# EAGLE board synth_revD (EAGLE 6.6.0), part 1 of 2
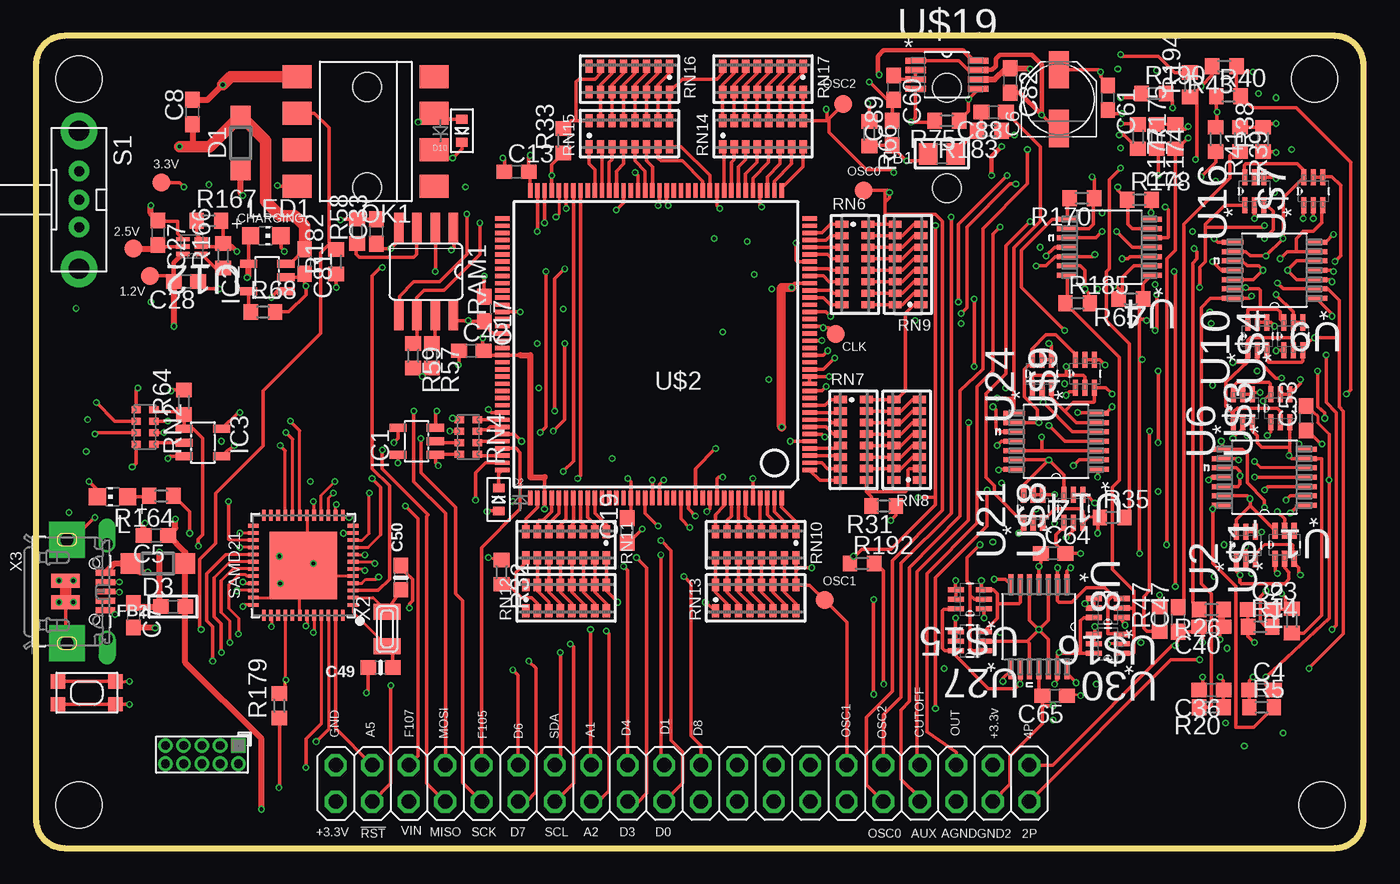
[diagram p6: board, top side]
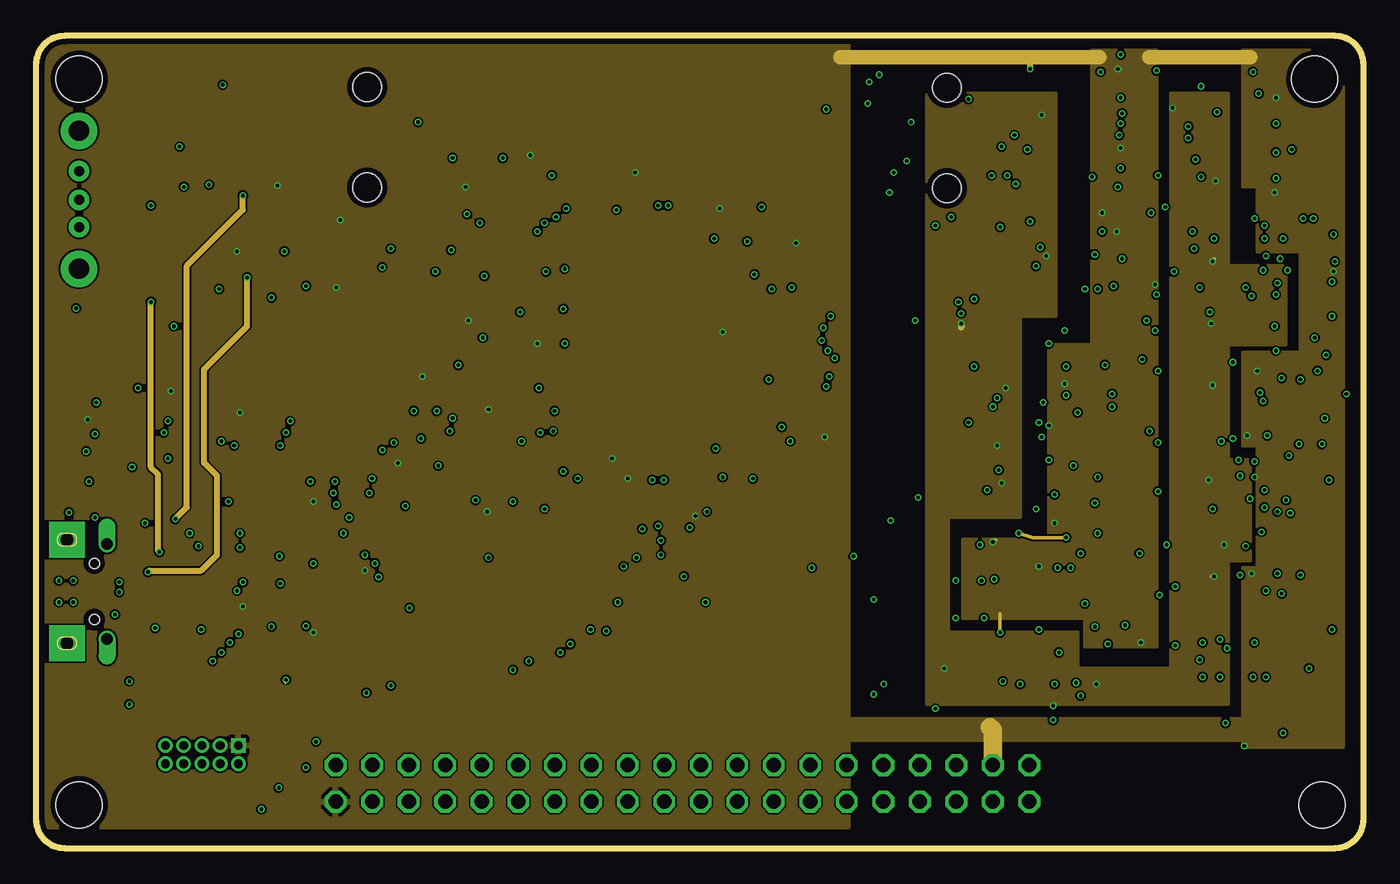
[diagram p7: board, inner layer Route2]
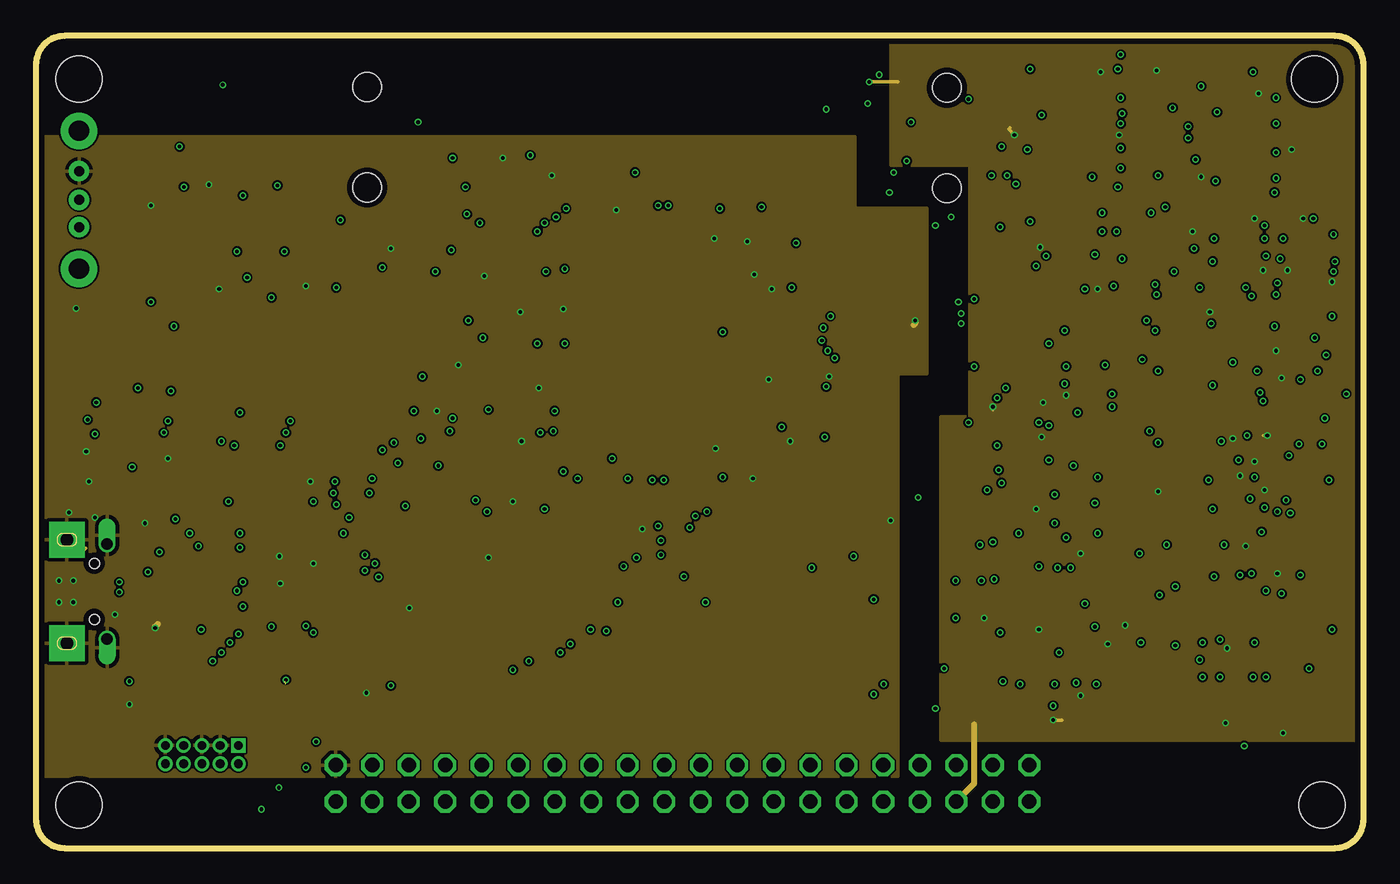
[diagram p8: board, inner layer Route15]
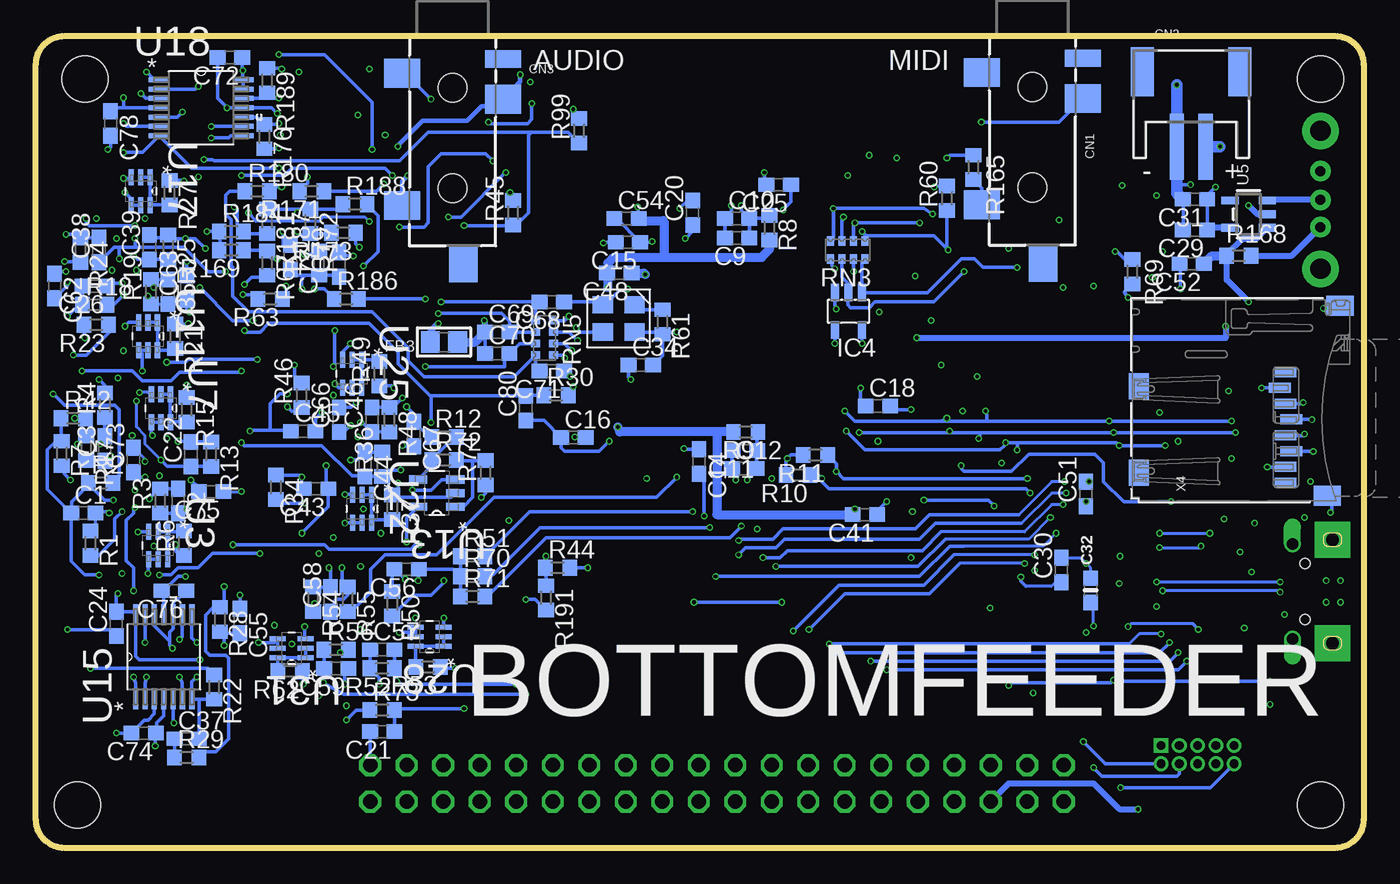
[diagram p9: board, bottom side, seen from below]

Size 92.4 x 56.5 mm. Coordinates in mm from the lower left corner, seen from the top.
Outline: 2,0 90.4,0 arc90 92.4,2 92.4,54.5 arc90 90.4,56.5 2,56.5 arc90 0,54.5 0,2 arc90 2,0
Copper layers (1*2*15*16): Top 0.035559375mm / dielectric 0.17018125mm / Route2 0.01778125mm / dielectric 47mil / Route15 0.01778125mm / dielectric 0.17018125mm / Bottom 0.035559375mm
Design rules "OSHPark-4layer *": minimum track width 5mil, minimum drill 10mil, track to track 5mil, track to pad 5mil, pad to pad 5mil, via to via 5mil, smd to smd 0mil, copper to edge 15mil, drill to drill 6mil, minimum pad ring 4mil, minimum via ring 4mil, stop-mask expansion 0mil, vias tented up to drill 0mil, thermal gap 10mil
Net classes: 3 usbvcc: width 0.102 mm, drill 0.1 mm, clearance 0.15 mm
Holes 3.2 mm at 89,53.5 3,53.5 89.5,3 3,3

## Footprints (pad centres in the part's own frame; a part is rotated, then mirrored left to right if it is on the bottom)
B1,27 = smd 1.27 x 1.27: TP 0,0
C0603 = smd 1.1 x 1: 1 -0.85,0; 2 0.85,0
PANASONIC_C = smd 2.6 x 1.4: + 2.05,0; - -2.05,0
0603-NO = smd 1.075 x 1: 1 -0.85,0; 2 0.85,0
4UCONN_19269 = smd 2 x 2.5: 1 2.5,-3.5; 2 11.7,-3.5; 3 4.3,3.5 | smd 2.5 x 2: 4 15.8,0.75 | smd 1.2 x 2.5: 5 1.5,3.5 | hole 2: 3.5,0; 10.5,0
JST-PH-2-SMT-RA = smd 1 x 4.6: 1 1,-3.7; 2 -1,-3.7 | smd 1.6 x 3.4: NC1 -3.4,1.5; NC2 3.4,1.5
SOD123 = smd 1.4 x 1.4: A 1.9,0; C -1.9,0
SOD-523 = smd 0.8 x 0.6: A 0,-0.8; K 0,0.8
0805 = smd 1.3 x 1.5: 1 -0.95,0; 2 0.95,0
0603 = smd 1.1 x 1: 1 -0.85,0; 2 0.85,0
SOT23-5L = smd 0.55 x 1.2: 1 -0.95,-1.3; 2 0,-1.3; 3 0.95,-1.3; 4 0.95,1.3; 5 -0.95,1.3
PINHEAD_2X05_127 = drill 0.6 pad 1.016 square: 1 -0.635,2.54 | drill 0.6 pad 1.016: 2 0.635,2.54; 3 -0.635,1.27; 4 0.635,1.27; 5 -0.635,0; 6 0.635,0; 7 -0.635,-1.27; 8 0.635,-1.27; 9 -0.635,-2.54; 10 0.635,-2.54
2X20 = drill 1.016 octagon: 1 -24.13,-1.27; 2 -24.13,1.27; 3 -21.59,-1.27; 4 -21.59,1.27; 5 -19.05,-1.27; 6 -19.05,1.27; 7 -16.51,-1.27; 8 -16.51,1.27; 9 -13.97,-1.27; 10 -13.97,1.27; 11 -11.43,-1.27; 12 -11.43,1.27; 13 -8.89,-1.27; 14 -8.89,1.27; 15 -6.35,-1.27; 16 -6.35,1.27; 17 -3.81,-1.27; 18 -3.81,1.27; 19 -1.27,-1.27; 20 -1.27,1.27; 21 1.27,-1.27; 22 1.27,1.27; 23 3.81,-1.27; 24 3.81,1.27; 25 6.35,-1.27; 26 6.35,1.27; 27 8.89,-1.27; 28 8.89,1.27; 29 11.43,-1.27; 30 11.43,1.27; 31 13.97,-1.27; 32 13.97,1.27; 33 16.51,-1.27; 34 16.51,1.27; 35 19.05,-1.27; 36 19.05,1.27; 37 21.59,-1.27; 38 21.59,1.27; 39 24.13,-1.27; 40 24.13,1.27
CHIP-LED0805 = smd 1.2 x 1.2: A 0,-1.05; C 0,1.05
DIL8-SMD = smd 1.6 x 2: 1 -3.81,-4.77; 2 -1.27,-4.77; 3 1.27,-4.77; 4 3.81,-4.77; 5 3.81,4.77; 6 1.27,4.77; 7 -1.27,4.77; 8 -3.81,4.77
R0603 = smd 1 x 1.1: 1 -0.85,0; 2 0.85,0
SO08 = smd 0.66 x 2.032: 1 -1.905,-3.073; 2 -0.635,-3.073; 3 0.635,-3.073; 4 1.905,-3.073; 5 1.905,3.073; 6 0.635,3.073; 7 -0.635,3.073; 8 -1.905,3.073
0603-ARC = smd 0.5 x 0.65: 1 -1.2,-0.625; 2 -0.4,-0.625; 3 0.4,-0.625; 4 1.2,-0.625; 5 1.2,0.625; 6 0.4,0.625; 7 -0.4,0.625; 8 -1.2,0.625
742-16 = smd 0.5 x 0.9: 1 -2.8,-0.9; 2 -2,-0.9; 3 -1.2,-0.9; 4 -0.4,-0.9; 5 0.4,-0.9; 6 1.2,-0.9; 7 2,-0.9; 8 2.8,-0.9; 9 2.8,0.9; 10 2,0.9; 11 1.2,0.9; 12 0.4,0.9; 13 -0.4,0.9; 14 -1.2,0.9; 15 -2,0.9; 16 -2.8,0.9
EG1213 = drill 0.7 pad 1.422: 1 -2,0; 2 0,0; 3 1.9,0 | drill 1.4 pad 2.54: MT1 -4.8,0; MT2 4.8,0
TQFN48_7MM = smd 0.25 x 0.75: 1 -2.75,-3.475; 2 -2.25,-3.475; 3 -1.75,-3.475; 4 -1.25,-3.475; 5 -0.75,-3.475; 6 -0.25,-3.475; 7 0.25,-3.475; 8 0.75,-3.475; 9 1.25,-3.475; 10 1.75,-3.475; 11 2.25,-3.475; 12 2.75,-3.475; 25 2.75,3.475; 26 2.25,3.475; 27 1.75,3.475; 28 1.25,3.475; 29 0.75,3.475; 30 0.25,3.475; 31 -0.25,3.475; 32 -0.75,3.475; 33 -1.25,3.475; 34 -1.75,3.475; 35 -2.25,3.475; 36 -2.75,3.475 | smd 0.75 x 0.25: 13 3.475,-2.75; 14 3.475,-2.25; 15 3.475,-1.75; 16 3.475,-1.25; 17 3.475,-0.75; 18 3.475,-0.25; 19 3.475,0.25; 20 3.475,0.75; 21 3.475,1.25; 22 3.475,1.75; 23 3.475,2.25; 24 3.475,2.75; 37 -3.475,2.75; 38 -3.475,2.25; 39 -3.475,1.75; 40 -3.475,1.25; 41 -3.475,0.75; 42 -3.475,0.25; 43 -3.475,-0.25; 44 -3.475,-0.75; 45 -3.475,-1.25; 46 -3.475,-1.75; 47 -3.475,-2.25; 48 -3.475,-2.75 | smd 4.7 x 4.7: THERMAL 0,0
KMR2 = smd 1 x 1: 1 2,0.8; 2 2,-0.8; 3 -2,0.8; 4 -2,-0.8
SOP65P640X120-14N = smd 1.473 x 0.356: 1 -2.921,1.956; 2 -2.921,1.295; 3 -2.921,0.66; 4 -2.921,0; 5 -2.921,-0.66; 6 -2.921,-1.295; 7 -2.921,-1.956; 8 2.921,-1.956; 9 2.921,-1.295; 10 2.921,-0.66; 11 2.921,0; 12 2.921,0.66; 13 2.921,1.295; 14 2.921,1.956
SOT65P210X110-6N = smd 1.118 x 0.356: 1 -0.965,0.66; 2 -0.965,0; 3 -0.965,-0.66; 4 0.965,-0.66; 5 0.965,0; 6 0.965,0.66
SOT23-5 = smd 0.55 x 1.2: 1 -0.95,-1.3; 2 0,-1.3; 3 0.95,-1.3; 4 0.95,1.3; 5 -0.95,1.3
SON50P150X150X80-6N = smd 0.914 x 0.305: 1 -0.635,0.508; 2 -0.635,0; 3 -0.635,-0.508; 4 0.635,-0.508; 5 0.635,0; 6 0.635,0.508
SOT95P280X145-5N = smd 1.27 x 0.559: 1 -1.295,0.94; 2 -1.295,0; 3 -1.295,-0.94; 4 1.295,-0.94; 5 1.295,0.94
SOT65P210X100-6N = smd 1.118 x 0.356: 1 -0.965,0.66; 2 -0.965,0; 3 -0.965,-0.66; 4 0.965,-0.66; 5 0.965,0; 6 0.965,0.66
TQ144 = smd 1 x 0.3: 1 -10.7,8.75; 2 -10.7,8.25; 3 -10.7,7.75; 4 -10.7,7.25; 5 -10.7,6.75; 6 -10.7,6.25; 7 -10.7,5.75; 8 -10.7,5.25; 9 -10.7,4.75; 10 -10.7,4.25; 11 -10.7,3.75; 12 -10.7,3.25; 13 -10.7,2.75; 14 -10.7,2.25; 15 -10.7,1.75; 16 -10.7,1.25; 17 -10.7,0.75; 18 -10.7,0.25; 19 -10.7,-0.25; 20 -10.7,-0.75; 21 -10.7,-1.25; 22 -10.7,-1.75; 23 -10.7,-2.25; 24 -10.7,-2.75; 25 -10.7,-3.25; 26 -10.7,-3.75; 27 -10.7,-4.25; 28 -10.7,-4.75; 29 -10.7,-5.25; 30 -10.7,-5.75; 31 -10.7,-6.25; 32 -10.7,-6.75; 33 -10.7,-7.25; 34 -10.7,-7.75; 35 -10.7,-8.25; 36 -10.7,-8.75; 73 10.7,-8.75; 74 10.7,-8.25; 75 10.7,-7.75; 76 10.7,-7.25; 77 10.7,-6.75; 78 10.7,-6.25; 79 10.7,-5.75; 80 10.7,-5.25; 81 10.7,-4.75; 82 10.7,-4.25; 83 10.7,-3.75; 84 10.7,-3.25; 85 10.7,-2.75; 86 10.7,-2.25; 87 10.7,-1.75; 88 10.7,-1.25; 89 10.7,-0.75; 90 10.7,-0.25; 91 10.7,0.25; 92 10.7,0.75; 93 10.7,1.25; 94 10.7,1.75; 95 10.7,2.25; 96 10.7,2.75; 97 10.7,3.25; 98 10.7,3.75; 99 10.7,4.25; 100 10.7,4.75; 101 10.7,5.25; 102 10.7,5.75; 103 10.7,6.25; 104 10.7,6.75; 105 10.7,7.25; 106 10.7,7.75; 107 10.7,8.25; 108 10.7,8.75 | smd 0.3 x 1: 37 -8.75,-10.7; 38 -8.25,-10.7; 39 -7.75,-10.7; 40 -7.25,-10.7; 41 -6.75,-10.7; 42 -6.25,-10.7; 43 -5.75,-10.7; 44 -5.25,-10.7; 45 -4.75,-10.7; 46 -4.25,-10.7; 47 -3.75,-10.7; 48 -3.25,-10.7; 49 -2.75,-10.7; 50 -2.25,-10.7; 51 -1.75,-10.7; 52 -1.25,-10.7; 53 -0.75,-10.7; 54 -0.25,-10.7; 55 0.25,-10.7; 56 0.75,-10.7; 57 1.25,-10.7; 58 1.75,-10.7; 59 2.25,-10.7; 60 2.75,-10.7; 61 3.25,-10.7; 62 3.75,-10.7; 63 4.25,-10.7; 64 4.75,-10.7; 65 5.25,-10.7; 66 5.75,-10.7; 67 6.25,-10.7; 68 6.75,-10.7; 69 7.25,-10.7; 70 7.75,-10.7; 71 8.25,-10.7; 72 8.75,-10.7; 109 8.75,10.7; 110 8.25,10.7; 111 7.75,10.7; 112 7.25,10.7; 113 6.75,10.7; 114 6.25,10.7; 115 5.75,10.7; 116 5.25,10.7; 117 4.75,10.7; 118 4.25,10.7; 119 3.75,10.7; 120 3.25,10.7; 121 2.75,10.7; 122 2.25,10.7; 123 1.75,10.7; 124 1.25,10.7; 125 0.75,10.7; 126 0.25,10.7; 127 -0.25,10.7; 128 -0.75,10.7; 129 -1.25,10.7; 130 -1.75,10.7; 131 -2.25,10.7; 132 -2.75,10.7; 133 -3.25,10.7; 134 -3.75,10.7; 135 -4.25,10.7; 136 -4.75,10.7; 137 -5.25,10.7; 138 -5.75,10.7; 139 -6.25,10.7; 140 -6.75,10.7; 141 -7.25,10.7; 142 -7.75,10.7; 143 -8.25,10.7; 144 -8.75,10.7
SMD-43.2X2.5 = smd 1.4 x 1.2: 1 -1.1,-0.95; 2 1.1,-0.95; 3 1.1,0.95; 4 -1.1,0.95
SOP65P490X110-8N = smd 1.422 x 0.432: 1 -2.184,0.965; 2 -2.184,0.33; 3 -2.184,-0.33; 4 -2.184,-0.965; 5 2.184,-0.965; 6 2.184,-0.33; 7 2.184,0.33; 8 2.184,0.965
XTAL3215 = smd 1.1 x 1.9: P$1 1.2,0; P$2 -1.2,0
4UCONN_20329_V2 = smd 1 x 2: BASE@1 -0.75,-2; BASE@2 0.75,-2 | smd 0.4 x 1.35: D+ 0,0.775; D- -0.65,0.775; GND 1.3,0.775; ID 0.65,0.775; VBUS -1.3,0.775 | drill 0.8 pad 1.2 offset: SPRT@1 -3.3,0.9; SPRT@2 3.3,0.9 | drill 0.9 pad 2.5 square: SPRT@3 -3.6,-1.9; SPRT@4 3.6,-1.9 | hole 0.7: -1.95,0; 1.95,0
MICROSD = smd 0.7 x 1.5: 1 9,-10.64; 2 7.9,-10.24; 3 6.8,-10.64; 4 5.7,-11.04; 5 4.6,-10.64; 6 3.5,-11.04; 7 2.4,-10.64; 8 1.3,-10.64 | smd 1.8 x 1.4: CD1 2,-0.44; CD2 8,-0.44 | smd 1.4 x 1.9: MT1 0.4,-13.54; MT2 13.6,-14.44

## Placement (x,y rotation side)
1.2V  TPB1,27  [B1,27]  7.95,39.8 0 top
2.5V  TPB1,27  [B1,27]  6.8,41.7 90 top
3.3V  TPB1,27  [B1,27]  8.75,46.3 90 top
C1  DNI  [C0603]  89.1,23.3 0 bottom
C2  100p  [C0603]  82.5,24.15 270 bottom
C3  DNI  [C0603]  87.6,27.8 90 bottom
C4  1n  [C0603]  85.3,11 0 top
C5  10n  [C0603]  8.35,21.75 180 top
C6  100u  [PANASONIC_C]  71.2,52.1 90 top
C7  .1u  [C0603]  6.8,16.2 270 top
C8  .1u  [C0603]  10.9,51.2 90 top
C9  10u  [C0603]  43.6,42.45 180 bottom
C10  .1u  [C0603]  43.6,43.8 0 bottom
C11  10u  [C0603]  43.05,27.65 180 bottom
C12  .1u  [C0603]  43.1,26.4 0 bottom
C13  .1u  [C0603]  33.45,47.05 0 top
C14  .1u  [C0603]  46.25,26.9 270 bottom
C15  .1u  [C0603]  51.2,42.15 180 bottom
C16  .1u  [C0603]  55,28.55 0 bottom
C17  .1u  [C0603]  31.2,37.5 270 top
C18  .1u  [C0603]  33.8,30.75 0 bottom
C19  .1u  [C0603]  41.15,22.1 90 top
C20  .1u  [C0603]  46.7,44.2 90 bottom
C21  10u  [C0603]  68.3,8.1 180 bottom
C22  100p  [C0603]  81.6,27.4 90 bottom
C23  1n  [C0603]  85.2,16.6 0 top
C24  10u  [C0603]  86.8,15.6 90 bottom
C25  .1u  [C0603]  40.7,46.15 180 bottom
C26  DNI  [C0603]  88.3,39.1 180 bottom
C27  1u  [C0603]  8.5,42.81 270 top
C28  1u  [C0603]  10.45,39.42 180 top
C29  10u  [C0603]  11.74,43 180 bottom
C30  1u  [C0603]  21.03,19.34 90 bottom
C31  1u  [C0603]  11.74,45.14 180 bottom
C32  1uF  [0603-NO]  18.99,17.92 90 bottom
C33  .1u  [C0603]  23.7,42.9 90 top
C34  .1u  [C0603]  50.3,33.6 0 bottom
C35  100p  [C0603]  83.2,38.7 270 bottom
C36  1n  [C0603]  81.8,11 180 top
C37  10u  [C0603]  81.9,7.6 0 bottom
C38  DNI  [C0603]  88,41.6 90 bottom
C39  100p  [C0603]  84.5,41.8 90 bottom
C40  1n  [C0603]  81.8,15.4 180 top
C41  .1u  [C0603]  34.7,23.2 180 bottom
C42  .1u  [C0603]  30.3,34.6 0 top
C43  DNI  [C0603]  72.9,25 180 bottom
C44  100p  [C0603]  69.5,26.7 270 bottom
C45  DNI  [C0603]  73.8,29 0 bottom
C46  100p  [C0603]  69,29.8 90 bottom
C47  10u  [C0603]  79.5,15.9 90 top
C48  .1u  [C0603]  51.8,40 180 bottom
C49  22pF  [0603-NO]  23.98,12.56 180 top
C50  22pF  [0603-NO]  25.41,18.82 90 top
C51  10u  [C0603]  19.33,24.64 90 bottom
C52  10u  [C0603]  11.96,40.65 180 bottom
C53  10u  [C0603]  88.4,29.9 90 top
C54  .1u  [C0603]  51.3,43.8 0 bottom
C55  10u  [C0603]  78.2,15.8 270 bottom
C56  DNI  [C0603]  66.6,19.4 180 bottom
C57  100p  [C0603]  68.3,13.8 0 bottom
C58  DNI  [C0603]  71.9,17.3 90 bottom
C59  100p  [C0603]  71.5,12.5 180 bottom
C60  1u  [C0603]  59.7,52.9 270 top
C61  .1u  [C0603]  74.6,52.2 270 top
C62  .1u  [C0603]  91.1,39.1 270 bottom
C63  .1u  [C0603]  81.9,39 90 bottom
C64  .1u  [C0603]  70.8,20.5 0 top
C65  .1u  [C0603]  70.9,10.6 180 top
C66  .1u  [C0603]  71.3,29.8 90 bottom
C67  .1u  [C0603]  66.1,28.8 270 bottom
C68  1u  [C0603]  56.5,38 180 bottom
C69  1u  [C0603]  60.3,35.9 0 bottom
C70  1u  [C0603]  60.3,34.4 0 bottom
C71  1u  [C0603]  56.5,33.2 180 bottom
C72  .1u  [C0603]  78.9,55 180 bottom
C73  .1u  [C0603]  85.6,27 90 bottom
C74  .1u  [C0603]  84.9,8 180 bottom
C75  .1u  [C0603]  80.2,24.8 180 bottom
C76  .1u  [C0603]  82.8,17.9 180 bottom
C77  .1u  [C0603]  74.7,41.1 270 bottom
C78  .1u  [C0603]  87.2,50.4 270 bottom
C79  .1u  [C0603]  71.3,40.6 90 bottom
C80  1u  [C0603]  58.3,30.6 90 bottom
C81  10u  [C0603]  18.7,40.8 270 top
C82  1u  [C0603]  67.8,53.4 270 top
C88  10u  [C0603]  66.65,51.2 180 top
C89  .1u  [C0603]  59.6,49.75 90 top
CLK  TPB1,27  [B1,27]  55.65,35.75 0 top
CN1  [4UCONN_19269]  23.05,56.45 270 bottom
CN2  [JST-PH-2-SMT-RA]  12,52.5 0 bottom
CN3  [4UCONN_19269]  63.4,56.4 270 bottom
D1  [SOD123]  14.25,49.05 90 top
D2  CDBU0520  [SOD-523]  32.2,24.25 0 top
D3  [SOD123]  8.5,19.8 180 top
D10  [SOD-523]  29.65,49.9 180 top
FB1  BLM21BD102SN1D  [0805]  63.05,48.3 180 top
FB2  [0603]  9.55,16.8 180 top
FB3  [0805]  64,35.2 180 bottom
IC1  74AHC1G125  [SOT23-5L]  26.5,28.3 90 top
IC2  MCP73831/OT  [SOT23-5L]  16.1,39.7 90 top
IC3  74AHC1G125  [SOT23-5L]  11.62,28.21 270 top
IC4  74AHC1G125  [SOT23-5L]  35.85,37.35 180 bottom
J100  PINHEAD-2x5-P1.27  [PINHEAD_2X05_127]  11.55,6.5 270 top
JP1  [2X20]  45,4.5 0 top
L  RED  [CHIP-LED0805]  5.33,24.44 90 top
LED1  [CHIP-LED0805]  16,42.6 270 top
OK1  6N137  [DIL8-SMD]  22.95,49.85 90 top
OSC0  TPB1,27  [B1,27]  57.6,45.75 0 top
OSC1  TPB1,27  [B1,27]  54.9,17.25 0 top
OSC2  TPB1,27  [B1,27]  56.2,51.75 0 top
R1  220  [R0603]  88.6,21.2 270 bottom
R2  10k  [R0603]  87.9,25.4 0 bottom
R3  10k  [R0603]  83.75,24.15 90 bottom
R4  220  [R0603]  87.6,30.8 90 bottom
R5  4.7k  [R0603]  85.3,9.8 0 top
R6  10k  [R0603]  82.1,21.2 90 bottom
R7  10k  [R0603]  90.6,27.45 270 bottom
R8  100R  [R0603]  41.35,43.15 270 bottom
R9  100R  [R0603]  43,28.95 180 bottom
R10  10k  [R0603]  39.35,25.95 180 bottom
R11  10k  [R0603]  38.15,27.35 180 bottom
R12  10k  [R0603]  64,28.6 0 bottom
R13  10k  [R0603]  80.2,27.4 270 bottom
R14  4.7k  [R0603]  85.2,15.4 0 top
R15  10k  [R0603]  81.9,30.5 270 bottom
R16  10k  [R0603]  87.4,15.8 90 top
R17  10k  [R0603]  88.9,27.8 270 bottom
R18  220  [R0603]  88.3,37.8 0 bottom
R19  10k  [R0603]  84.4,38.7 90 bottom
R20  4.7k  [R0603]  81.8,9.8 180 top
R21  10k  [R0603]  82.7,35.6 270 bottom
R22  10k  [R0603]  80,11.2 270 bottom
R23  10k  [R0603]  88.2,36.4 180 bottom
R24  220  [R0603]  89.3,41.6 270 bottom
R25  10k  [R0603]  83.2,41.8 270 bottom
R26  4.7k  [R0603]  81.8,16.6 180 top
R27  10k  [R0603]  83.1,45.6 270 bottom
R28  10k  [R0603]  79.6,15.9 270 bottom
R29  10k  [R0603]  81.9,6.3 0 bottom
R30  10k  [R0603]  56.2,31.5 0 bottom
R31  20k  [R0603]  59,23.8 180 top
R32  20k  [R0603]  32.4,19.2 270 top
R33  20k  [R0603]  36.7,49.2 90 top
R34  220  [R0603]  75.7,25.1 270 bottom
R35  10k  [R0603]  74.9,23 0 top
R36  27k  [R0603]  68.3,26.7 90 bottom
R37  10k  [R0603]  67.6,23.7 270 bottom
R38  10k  [R0603]  85.4,49.3 90 top
R39  10k  [R0603]  83.8,49.3 270 top
R40  10k  [R0603]  83,52.3 0 top
R41  10k  [R0603]  82.1,49.3 270 top
R42  10k  [R0603]  89.8,29.9 0 bottom
R43  10k  [R0603]  82.7,54.4 180 top
R44  63.5k  [R0603]  56.1,19.5 0 bottom
R45  63.5k  [R0603]  59.2,44.2 90 bottom
R46  220  [R0603]  73.9,31.5 90 bottom
R47  10k  [R0603]  78.2,15.9 90 top
R48  63.5k  [R0603]  67.8,29.8 270 bottom
R49  10k  [R0603]  68.5,33 90 bottom
R50  220  [R0603]  67.6,17 270 bottom
R51  10k  [R0603]  62,20.3 0 bottom
R52  10k  [R0603]  68.3,12.5 180 bottom
R53  10k  [R0603]  65.1,12.6 180 bottom
R54  220  [R0603]  73.1,17.3 270 bottom
R55  10k  [R0603]  70.7,17.3 270 bottom
R56  10k  [R0603]  71.5,13.8 0 bottom
R57  10k  [R0603]  27.55,34.25 270 top
R58  10k  [R0603]  22.35,42.9 90 top
R59  10k  [R0603]  26.25,34.25 270 top
R60  10k  [R0603]  29,45.2 90 bottom
R61  1k  [R0603]  48.8,36.6 270 bottom
R62  10k  [R0603]  74.7,12.3 180 bottom
R63  180k  [R0603]  76.1,38.2 180 bottom
R64  10k  [R0603]  10.3,31.02 90 top
R65  10k  [R0603]  76.2,38.2 180 top
R66  20k  [R0603]  58,49.7 270 top
R67  10k  [R0603]  76.3,40.7 270 bottom
R68  10k  [R0603]  15.8,37.3 0 top
R69  1k  [R0603]  16.1,40.1 270 bottom
R70  10k  [R0603]  62,18.9 0 bottom
R71  10k  [R0603]  62,17.5 0 bottom
R72  10k  [R0603]  64,27 0 bottom
R73  10k  [R0603]  68.3,9.6 0 bottom
R74  63.5k  [R0603]  61.1,26.1 90 bottom
R75  20k  [R0603]  63.4,50.6 180 top
R99  63.5k  [R0603]  54.6,49.9 90 bottom
R164  2.2k  [R0603]  8.73,24.5 180 top
R165  220  [R0603]  27.15,47.35 270 bottom
R166  10k  [R0603]  13.03,41.2 90 top
R167  10k  [R0603]  12.04,43.64 0 top
R168  100k  [R0603]  8.68,41.21 0 bottom
R169  550  [R0603]  78.8,41.6 180 bottom
R170  10k  [R0603]  72.8,45.2 180 top
R171  180k  [R0603]  73.2,45.7 180 bottom
R172  10k  [R0603]  73.3,43.6 270 bottom
R173  550  [R0603]  71,42.8 180 bottom
R174  180k  [R0603]  78,49.5 270 top
R175  10k  [R0603]  79.3,49.5 90 top
R176  10k  [R0603]  76.5,49.5 270 bottom
R177  550  [R0603]  76.7,49.5 270 top
R178  10k  [R0603]  76.8,45.1 0 top
R179  330  [R0603]  16.95,9.9 90 top
R180  180k  [R0603]  77,45.7 0 bottom
R181  10k  [R0603]  76.3,43.6 270 bottom
R182  10k  [R0603]  20.9,40.8 90 top
R183  100k  [R0603]  66.35,49.9 180 top
R184  550  [R0603]  78.8,42.9 0 bottom
R185  10k  [R0603]  72.5,37.9 0 top
R186  180k  [R0603]  70.8,38.2 0 bottom
R187  550  [R0603]  72.7,40.7 90 bottom
R188  10k  [R0603]  70.2,44.8 0 bottom
R189  100k  [R0603]  76.3,53.4 270 bottom
R190  100k  [R0603]  77.8,52.5 0 top
R191  63.5k  [R0603]  56.9,17.4 270 bottom
R192  63.5k  [R0603]  57.5,19.8 0 top
R194  63.5k  [R0603]  80.3,53.1 90 top
RAM1  N25Q032A13ESC40FTR  [SO08]  27.15,40.1 180 top
RN2  33  [0603-ARC]  7.6,29.3 90 top
RN3  33  [0603-ARC]  35.9,41.6 0 bottom
RN4  33  [0603-ARC]  30.1,28.6 90 top
RN5  10k  [0603-ARC]  57,35.5 90 bottom
RN6  20k  [742-16]  57,40.6 270 top
RN7  20k  [742-16]  56.9,28.4 270 top
RN8  10k  [742-16]  60.6,28.4 90 top
RN9  10k  [742-16]  60.7,40.6 90 top
RN10  20k  [742-16]  50.1,21.1 180 top
RN11  20k  [742-16]  36.9,21.1 180 top
RN12  10k  [742-16]  36.9,17.4 0 top
RN13  10k  [742-16]  50.1,17.4 0 top
RN14  10k  [742-16]  50.6,49.7 0 top
RN15  10k  [742-16]  41.3,49.7 0 top
RN16  10k  [742-16]  41.3,53.5 180 top
RN17  10k  [742-16]  50.6,53.5 180 top
S1  EG1213  [EG1213]  3,45.1 270 top
SAMD21  ATSAMD21G18_QFN  [TQFN48_7MM]  18.61,19.67 90 top
SW1  SPST_TACT-KMR2  [KMR2]  3.54,10.8 0 top
U1  TLV274IPWR  [SOP65P640X120-14N]  85.5,25.8 180 top
U2  DMMT3906W-7-F  [SOT65P210X110-6N]  84.2,21.05 90 top
U3  DMMT3906W-7-F  [SOT65P210X110-6N]  83.9,21.05 270 bottom
U4  TLV274IPWR  [SOP65P640X120-14N]  74.7,41.8 180 top
U5  mic5225-3.3  [SOT23-5]  8,44.1 90 bottom
U6  DMMT3906W-7-F  [SOT65P210X110-6N]  84,30.6 90 top
U7  DMMT3906W-7-F  [SOT65P210X110-6N]  83.7,30.6 270 bottom
U8  TLV274IPWR  [SOP65P640X120-14N]  69.8,15.4 270 top
U9  TLV274IPWR  [SOP65P640X120-14N]  86.2,40.2 180 top
U10  DMMT3906W-7-F  [SOT65P210X110-6N]  85,35.6 90 top
U11  DMMT3906W-7-F  [SOT65P210X110-6N]  84.6,35.6 270 bottom
U12  TLV7101828DSER  [SON50P150X150X80-6N]  10.87,41.85 180 top
U13  TLV2471IDBVT  [SOT95P280X145-5N]  64.5,24.7 180 bottom
U14  TLV274IPWR  [SOP65P640X120-14N]  71,28.3 180 top
U15  TLV274IPWR  [SOP65P640X120-14N]  83.5,13.3 90 bottom
U16  DMMT3906W-7-F  [SOT65P210X110-6N]  84.8,45.7 90 top
U17  DMMT3906W-7-F  [SOT65P210X110-6N]  85.1,45.7 270 bottom
U18  TLV274IPWR  [SOP65P640X120-14N]  80.9,51.5 0 bottom
U21  DMMT3906W-7-F  [SOT65P210X110-6N]  69.4,23.6 90 top
U22  DMMT3906W-7-F  [SOT65P210X110-6N]  69.7,23.6 270 bottom
U24  DMMT3906W-7-F  [SOT65P210X110-6N]  70,33 90 top
U25  DMMT3906W-7-F  [SOT65P210X110-6N]  70.4,33 270 bottom
U27  DMMT3906W-7-F  [SOT65P210X110-6N]  65,14.4 180 top
U28  DMMT3906W-7-F  [SOT65P210X110-6N]  65,14.7 180 bottom
U30  DMMT3906W-7-F  [SOT65P210X110-6N]  74.6,14.2 180 top
U31  DMMT3906W-7-F  [SOT65P210X110-6N]  74.6,13.9 180 bottom
U$1  DMMT3904W-7-F  [SOT65P210X100-6N]  86.9,21.1 90 top
U$2  ICE40HX4K  [TQ144]  43.15,35.05 180 top
U$3  DMMT3904W-7-F  [SOT65P210X100-6N]  86.6,30.6 90 top
U$4  DMMT3904W-7-F  [SOT65P210X100-6N]  87.5,35.6 90 top
U$5  SIT1602  [SMD-43.2X2.5]  51.85,36.85 180 bottom
U$7  DMMT3904W-7-F  [SOT65P210X100-6N]  88.9,45.7 90 top
U$8  DMMT3904W-7-F  [SOT65P210X100-6N]  72.2,23.6 90 top
U$9  DMMT3904W-7-F  [SOT65P210X100-6N]  73,33 90 top
U$15  DMMT3904W-7-F  [SOT65P210X100-6N]  65,17.3 180 top
U$16  DMMT3904W-7-F  [SOT65P210X100-6N]  74.6,16.7 180 top
U$19  LM4819MMX  [SOP65P490X110-8N]  63.4,53.8 0 top
X2  32.768  [XTAL3215]  24.44,15.24 270 top
X3  microUSB  [4UCONN_20329_V2]  4.06,17.85 270 top
X4  microsd  [MICROSD]  16.07,24.12 90 bottom